# Altium schematic sheet 3_power.SchDoc
size A4; SheetNumber: 3; SheetTotal: 6
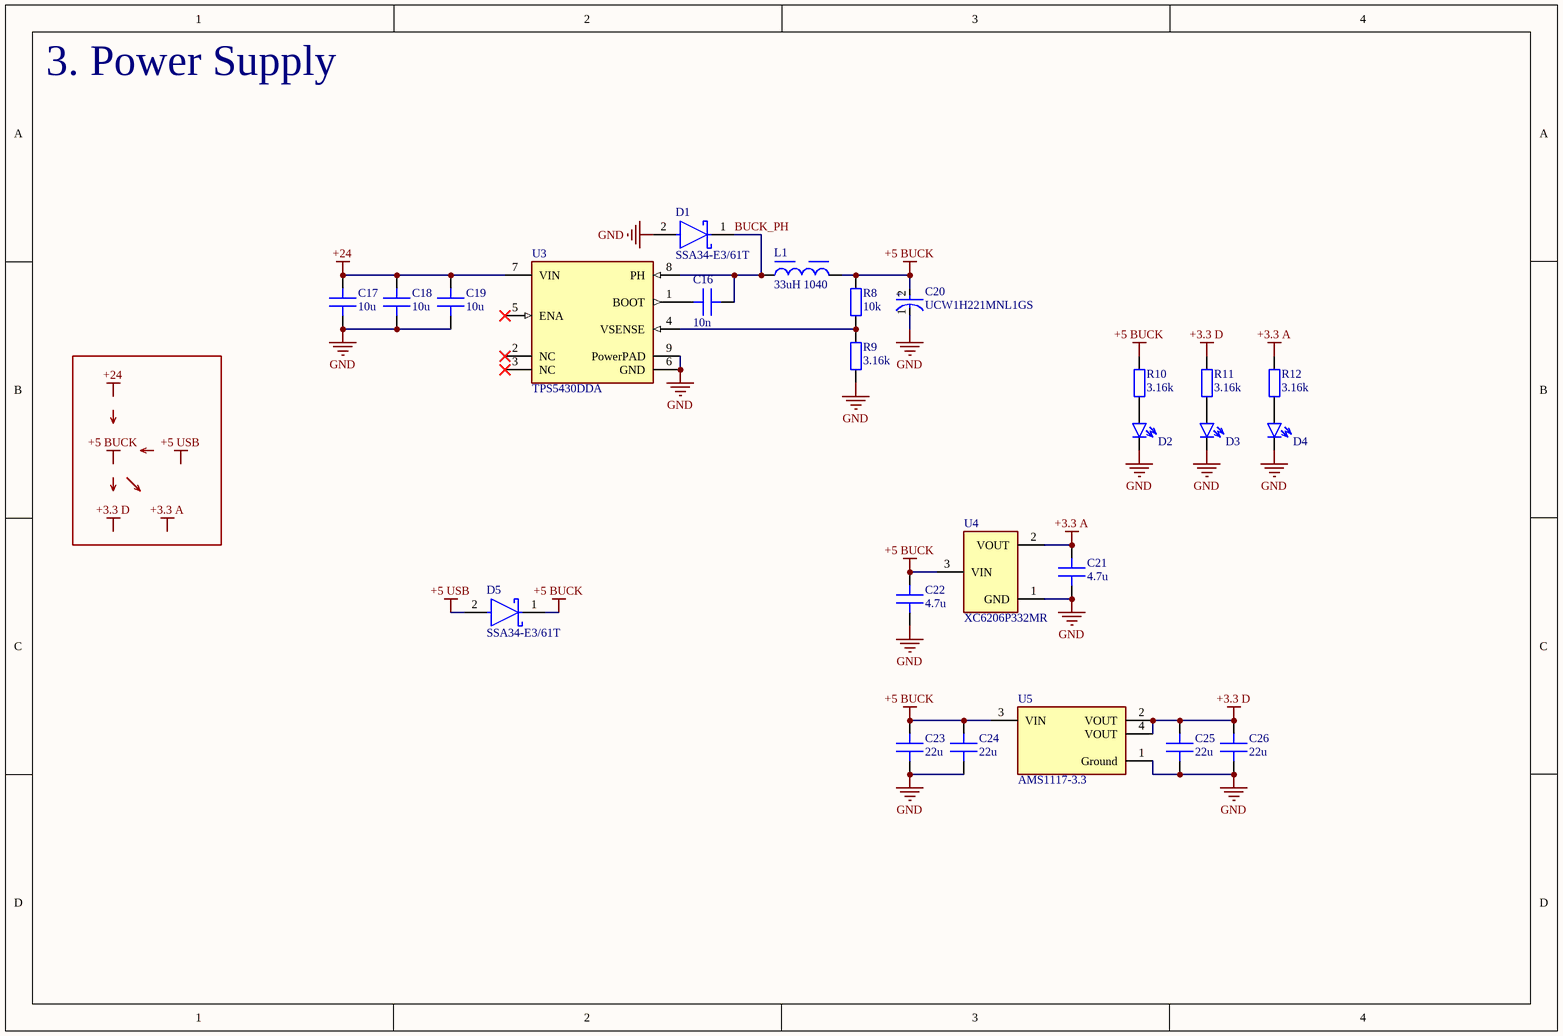
[diagram p0: 3_power.SchDoc]

## Parts
C16  10n  [IPC C C0402 NO SILK]
C17  10u  [IPC C C1210 NO SILK]
C18  10u  [IPC C C1210 NO SILK]
C19  10u  [IPC C C1210 NO SILK]
C20  UCW1H221MNL1GS  [FP-UCW1H221MNL1GS-MFG]
C21  4.7u  [IPC C C0603 NO SILK]
C22  4.7u  [IPC C C0603 NO SILK]
C23  22u  [IPC C C0603 NO SILK]
C24  22u  [IPC C C0603 NO SILK]
C25  22u  [IPC C C0603 NO SILK]
C26  22u  [IPC C C0603 NO SILK]
D1  SSA34-E3/61T  [FP-95400-MFG]
D2  Red LED 0603  [IPC C D0603]  (value not drawn)
D3  Yellow LED 0603  [IPC C D0603]  (value not drawn)
D4  Yellow LED 0603  [IPC C D0603]  (value not drawn)
D5  SSA34-E3/61T  [FP-95400-MFG]
L1  33uH 1040  [WE-LHMI_1040]
R8  10k  [IPC C R0402 NO SILK]
R9  3.16k  [IPC C R0402 NO SILK]
R10  3.16k  [IPC C R0402 NO SILK]
R11  3.16k  [IPC C R0402 NO SILK]
R12  3.16k  [IPC C R0402 NO SILK]
U3  TPS5430DDA  [FP-DDA0008J-MFG]
U4  XC6206P332MR  [SOT23-3]
U5  AMS1117-3.3  [FP-AMS1117-IPC_C]

## Nets
+3.3 A: C21.2 R12.2 U4.2(VOUT)
+3.3 D: C25.2 C26.2 R11.2 U5.2(VOUT) U5.4(VOUT)
+5 BUCK: C20.2(A) C22.2 C23.2 C24.2 D5.1(C) L1.2 R8.2 R10.2 U4.3(VIN) U5.3(VIN)
+5 USB: D5.2(A)
+24: C17.1 C18.1 C19.1 U3.7(VIN)
GND: C17.2 C18.2 C19.2 C20.1(C) C21.1 C22.1 C23.1 C24.1 C25.1 C26.1 D1.2(A) D2.2(C) D3.2(C) D4.2(C) R9.1 U3.6(GND) U3.9(PowerPAD) U4.1(GND) U5.1(Ground)
BUCK_PH: C16.2 D1.1(C) L1.1 U3.8(PH)
NetC16_1: C16.1 U3.1(BOOT)
NetD2_1: D2.1(A) R10.1
NetD3_1: D3.1(A) R11.1
NetD4_1: D4.1(A) R12.1
NetR8_1: R8.1 R9.2 U3.4(VSENSE)

Not connected (* = marked no-connect by the designer): U3 2(NC)* 3(NC)* 5(ENA)*

## Notes on the sheet
- 3. Power Supply
- Labels drawn without touching a wire or pin: +3.3 A, +3.3 D, +5 BUCK, +5 USB, +24
- (in symbol CMP-12462-000041-1) +

## Library data of the parts
C16 = Generic CAP 0402: Value: 10n
C17-C19 = Generic CAP 1210: Value: 10u
C20 = CMP-12462-000041-1: CAP ALUM 220UF 20% 50V SMD; Dissipation Factor: 0.14%; Ripple Current: 670mA; Dielectric Material: Aluminium; Life (Hours): 7000Hour; Impedance: 350mR; Leakage Current: 3uA; Capacitance: 220uF; Max Operating Temperature: 105°C; Features: General Purpose; Voltage Rating: 50V; Case/Package: Radial; Termination: SMD/SMT; Tolerance: 20%; Package Quantity: 500; Construction: Cylindrical; REACH SVHC: No SVHC; Width: 10.3mm; Min Operating Temperature: -25°C; RoHS Compliant: Yes; Mount: Surface Mount; Diameter: 10mm; Voltage: 50V; Series: CW; Voltage Rating (DC): 50V; Ripple Current (AC): 670mA; Radiation Hardening: No; Length: 10mm; Packaging: Tape and Reel; Height: 10mm; Height - Seated (Max): 0.394inch
C21-C26 = Generic CAP 0603
  C21 C22: Value: 4.7u
  C23-C26: Value: 22u
D1 D5 = CMP-02539-000022-2: DIODE SCHOTTKY 40V 3A DO214AC; Element Configuration: Single; Max Reverse Leakage Current: 200uA; Polarity: Standard; Peak Non-Repetitive Surge Current: 75A; Forward Voltage: 490mV; Radiation Hardening: No; Current Rating: 3A; Contact Plating: Tin; Output Current: 3A; Height: 2.087mm; Mount: Surface Mount; Case/Package: SMA; Packaging: Tape and Reel; Width: 2.79mm; Average Rectified Current: 3A; Max Repetitive Reverse Voltage (Vrrm): 40V; Max Operating Temperature: 150°C; Length: 4.5mm; RoHS Compliant: Yes; Max Reverse Current: 200uA; Voltage Rating (DC): 40V; Min Operating Temperature: -65°C; Max Reverse Voltage (DC): 40V; Number of Pins: 2; Max Forward Surge Current (Ifsm): 75A; Lead Free: Lead Free; Forward Current: 3A; Max Surge Current: 75A; Package Quantity: 1
D2-D4 = Generic LED 0603
L1 = CMP-1353-00014-4: NexarPartId: 67091305; Saturation Current: 3.3A; DC Resistance (DCR): 92mΩ; Inductance Tolerance: 20%; Inductance: 33µH; Max Operating Temperature: 125°C; Ambient Temperature Range High: 85°C; Min Operating Temperature: -40°C; Length: 11mm; Ambient Temperature Range Low: -40°C; Height: 3.8mm; Width: 10mm; RoHS: Compliant
R8-R12 = Generic RES 0402
  R8: Value: 10k
  R9-R12: Value: 3.16k
U3 = CMP-2000-04960-2: IC REG BUCK ADJUSTABLE 3A 8SOPWR; Manufacturer: Texas Instruments; Max Junction Temp: +125°C; Max Supply Voltage: 36V; Switching Frequency: 500kHz; Output Type: AdjustableProgrammable; Standoff Height: 0mm; Output Voltage: 1.23-31V; Max Duty Cycle: 89%; Nominal Supply Current: 3mA; Min Supply Voltage: 5.5V; Number Of Outputs: 1; Temperature: -40°C to +125°C; Temperature Range High: +125°C; Manufacturer Part Number: TPS5430DDA; Device Class L3: Voltage Regulators - Switching; Mouser Description: Voltage Regulators - Switching Regulators 5.5 to 36V Input 3A Step Dwn Converter; Switching Topology: Buck; ComponentLink2URL: http://www.ti.com/lit/ds/symlink/tps5431.pdf; ComponentLink2Description: Datasheet; Device Class L2: Power Management ICs; Device Class L1: Integrated Circuits (ICs); Digikey Description: IC REG BUCK ADJUSTABLE 3A 8SOPWR; RoHS: TRUE; Octopart: https://octopart.com/tps5430dda-texas+instruments-589977; Output Current: 3A; Automotive: No; Lead Free: Yes; Category: IC; Package: DDA0008J; Temperature Range Low: -40°C; Height: 1.7mm
U4 = 3.3V Regulator XC6206P332MR_C5446: Output Type: Output Polarity:Positive Number of Outputs:1 Maximum Input Voltage:6V Output Voltage:3.3V~3.3V Output Voltage:3.3V~3.3V Dropout Voltage:680mV@(100mA) Output Current:200mA Power Supply Rejection Ratio (PSRR):-; Manufacturer: TOREX(特瑞仕); Add into BOM: yes; Number of Outputs: 1; Maximum Input Voltage: 6V; Output Current: 200mA; Symbol: XC6206P332MR; Device: XC6206P332MR_C5446; LCSC Part Name: 正 Vin=6V Vout=3.3V 200mA; Supplier Part: C5446; Manufacturer Part: XC6206P332MR; Supplier Footprint: SOT-23-3L; JLCPCB Part Class: Basic Part; Datasheet: https://atta.szlcsc.com/upload/public/pdf/source/20130801/1457706628791.pdf; Supplier: LCSC; Convert to PCB: yes; Output Polarity: Positive; Output Voltage: 3.3V~3.3V; Dropout Voltage: 680mV@(100mA); Power Supply Rejection Ratio (PSRR): -
U5 = CMP-209535-000001-1: LDO Voltage Regulators 1A, 3.3V; Manufacturer: Advanced Monolithic Systems; Dropout Voltage: 1.1V; Output Type: Fixed; Nominal Supply Current: 5mA; Max Power Dissipation: 1.2W; Max Supply Voltage: 15V; Number Of Outputs: 1; Standoff Height: 0.64mm; Max Junction Temp: +125°C; Height: 1.8mm; Package: AMS1117; Device Class L2: Power Management ICs; ComponentLink2Description: Datasheet; ComponentLink2URL: http://www.advanced-monolithic.com/pdf/ds1117.pdf; Category: IC; RoHS: TRUE; Automotive: No; Device Class L1: Integrated Circuits (ICs); Output Current: 1A; Device Class L3: Voltage Regulators - Linear; Temperature: -40°C to +125°C; Output Voltage: 3.3V; Manufacturer Part Number: AMS1117-3.3; Temperature Range Low: -40°C; Octopart: https://octopart.com/ams1117-3.3-advanced+monolithic+systems-25899300; Lead Free: Yes; Ipc Land Pattern Name: SOT229P700X180-4; Temperature Range High: +125°C